# EAGLE design V2 (EAGLE 6.5.0)
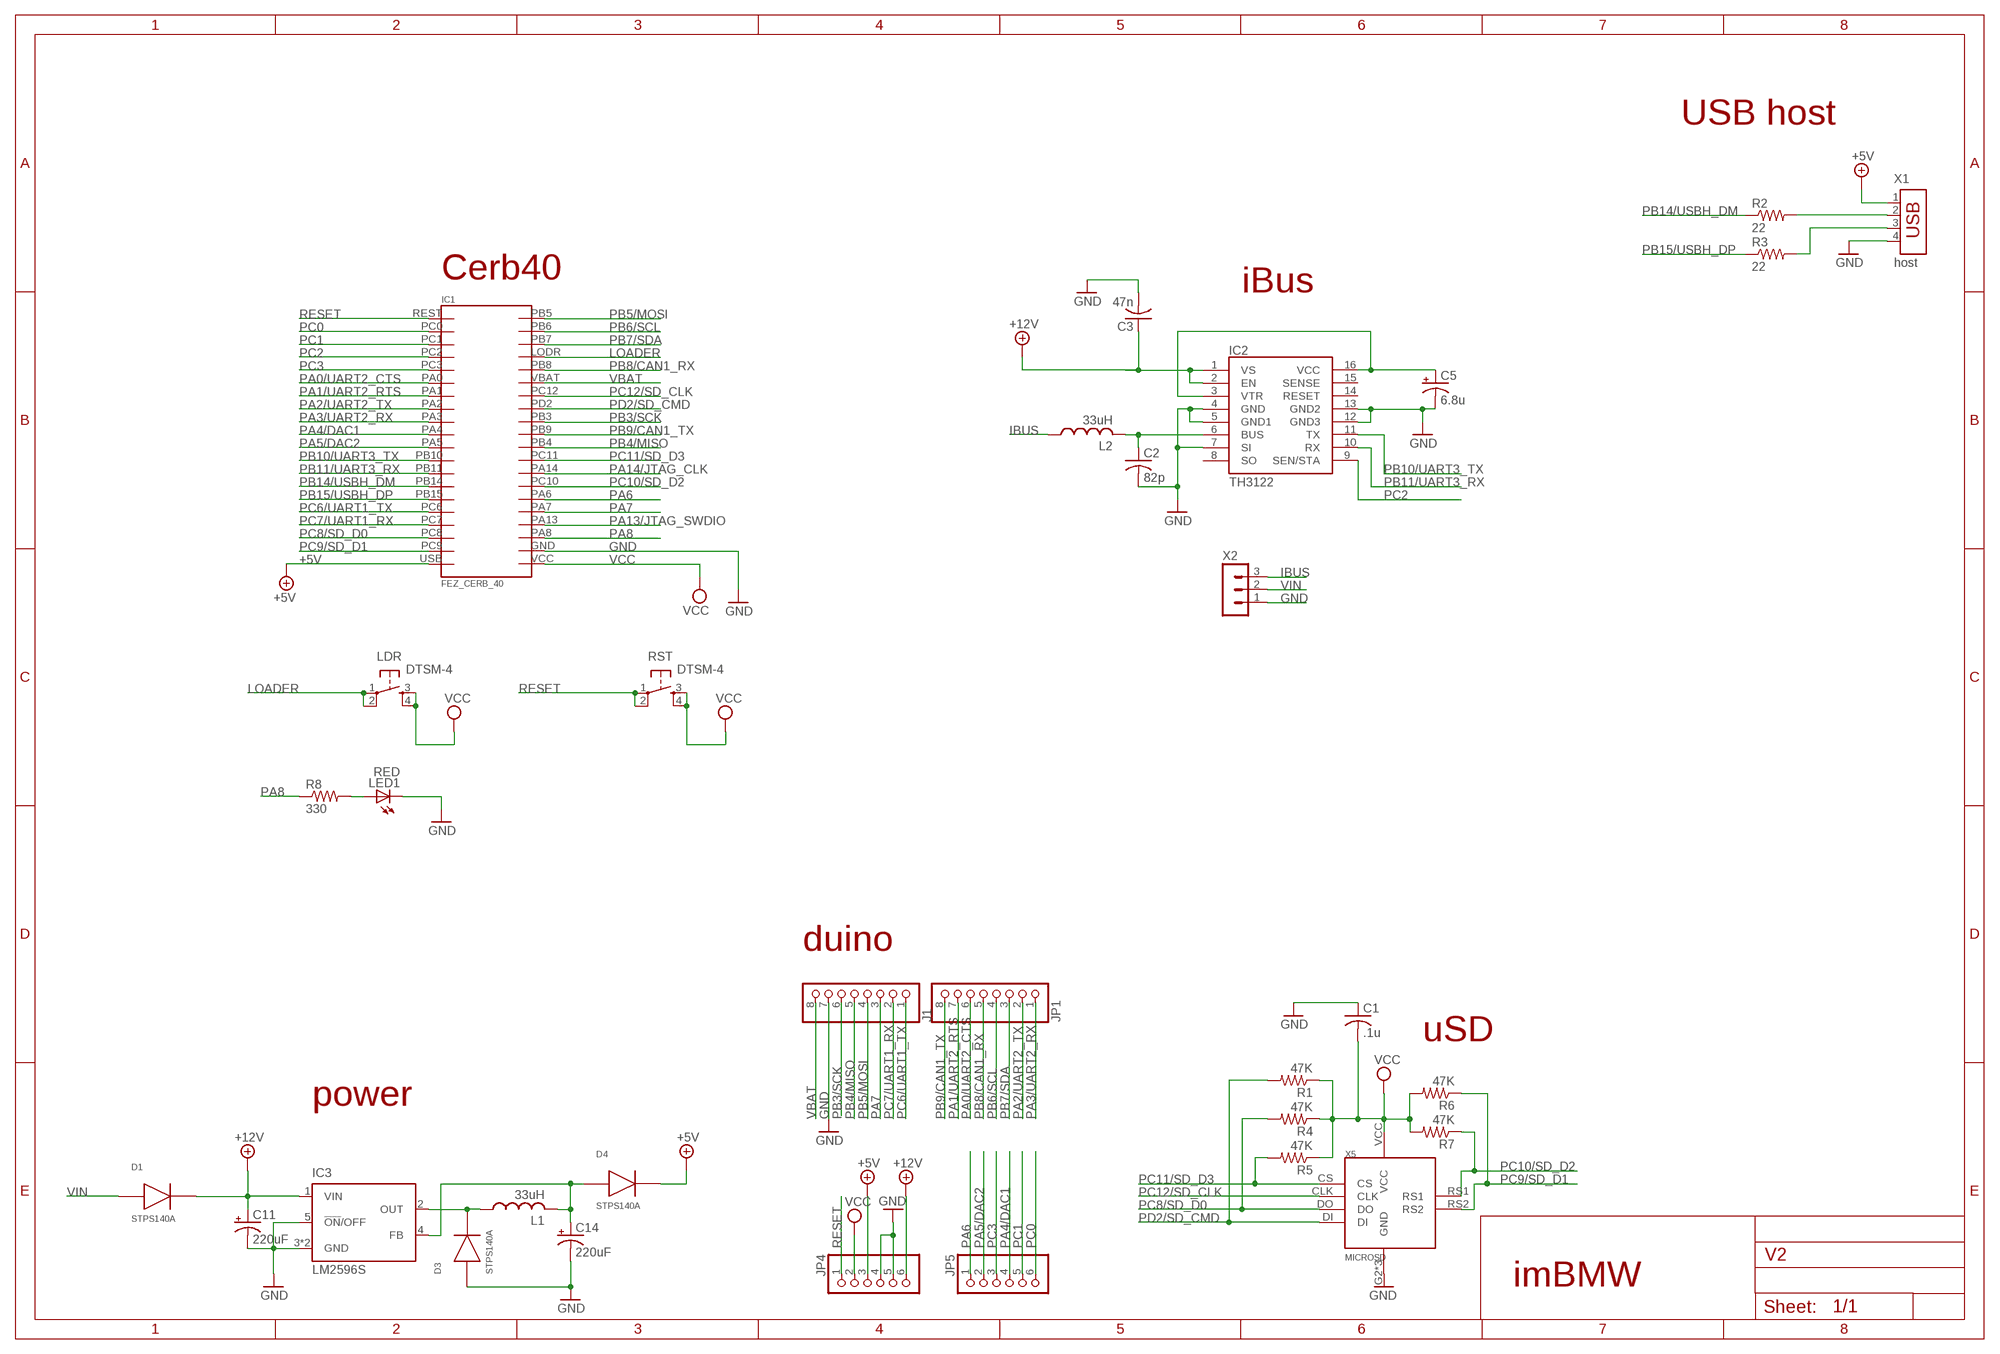
[diagram p0: schematic, sheet 1]

## Parts
C1  .1u  C-USC0805  [C0805]
C2  82p  C-USC0805  [C0805]
C3  47n  C-USC0805  [C0805]
C5  6.8u  CPOL-USSMCB  [SMC_B]
C11  220uF  CPOL-USSMCD  [SMC_D]
C14  220uF  CPOL-USSMCD  [SMC_D]
D1  STPS140A  DIODE_SMA  [DIODE_SMA]
D3  STPS140A  DIODE_SMA  [DIODE_SMA]
D4  STPS140A  DIODE_SMA  [DIODE_SMA]
IC1  FEZ_CERB_40  [FEZ_CERB_40]
IC2  TH3122  [SO16L]
IC3  LM2596S  [TO263-5]
J1  PINHD-1X8  [1X08]
JP1  PINHD-1X8  [1X08]
JP4  PINHD-1X6  [1X06]
JP5  PINHD-1X6  [1X06]
L1  33uH  L-USWE-TPC  [POWER-CHOKE_WE-TPC]
L2  33uH  L-USWE-TPC  [POWER-CHOKE_WE-TPC]
LDR  DTSM-4  [DTSM-4]
LED1  RED  LEDSML0603  [SML0603]
R1  47K  R-US_R0805  [R0805]
R2  22  R-US_R0805  [R0805]
R3  22  R-US_R0805  [R0805]
R4  47K  R-US_R0805  [R0805]
R5  47K  R-US_R0805  [R0805]
R6  47K  R-US_R0805  [R0805]
R7  47K  R-US_R0805  [R0805]
R8  330  R-US_R0805  [R0805]
RST  DTSM-4  [DTSM-4]
X1  host  USB-787616  [USB]
X2  MA03-1  [MA03-1]
X5  MICROSD  [MICROSD]

## Nets
+5V: D4.K IC1.USB JP4.3 X1.1
+12V: C3.1 C11.+ D1.K IC2.1(VS) IC2.2(EN) IC3.1(VIN) JP4.6
GND: C1.1 C2.2 C3.2 C5.- C11.- C14.- D3.A IC1.GND IC2.4(GND) IC2.5(GND1) IC2.7(SI) IC2.12(GND3) IC2.13(GND2) IC3.3(GND) IC3.5(!ON!/OFF) IC3.6(GND) J1.7 JP4.4 JP4.5 LED1.C X1.4 X2.1 X5.G2(GND) X5.G3(GND) X5.GND
IBUS: L2.1 X2.3
LOADER: IC1.LODR LDR.1 LDR.2
N$1: C14.+ D4.A IC3.4(FB) L1.2
N$4: C2.1 IC2.6(BUS) L2.2
N$6: D3.K IC3.2(OUT) L1.1
N$11: C5.+ IC2.3(VTR) IC2.16(VCC)
N$26: LED1.A R8.2
N$146: R2.2 X1.2
N$152: R3.2 X1.3
PA0/UART2_CTS: IC1.PA0 JP1.6
PA1/UART2_RTS: IC1.PA1 JP1.7
PA2/UART2_TX: IC1.PA2 JP1.2
PA3/UART2_RX: IC1.PA3 JP1.1
PA4/DAC1: IC1.PA4 JP5.4
PA5/DAC2: IC1.PA5 JP5.2
PA6: IC1.PA6 JP5.1
PA7: IC1.PA7 J1.3
PA8: IC1.PA8 R8.1
PA13/JTAG_SWDIO: IC1.PA13
PA14/JTAG_CLK: IC1.PA14
PB3/SCK: IC1.PB3 J1.6
PB4/MISO: IC1.PB4 J1.5
PB5/MOSI: IC1.PB5 J1.4
PB6/SCL: IC1.PB6 JP1.4
PB7/SDA: IC1.PB7 JP1.3
PB8/CAN1_RX: IC1.PB8 JP1.5
PB9/CAN1_TX: IC1.PB9 JP1.8
PB10/UART3_TX: IC1.PB10 IC2.11(TX)
PB11/UART3_RX: IC1.PB11 IC2.10(RX)
PB14/USBH_DM: IC1.PB14 R2.1
PB15/USBH_DP: IC1.PB15 R3.1
PC0: IC1.PC0 JP5.6
PC1: IC1.PC1 JP5.5
PC2: IC1.PC2 IC2.9(SEN/STA)
PC3: IC1.PC3 JP5.3
PC6/UART1_TX: IC1.PC6 J1.1
PC7/UART1_RX: IC1.PC7 J1.2
PC8/SD_D0: IC1.PC8 R4.2 X5.DO
PC9/SD_D1: IC1.PC9 R6.1 X5.RS2
PC10/SD_D2: IC1.PC10 R7.1 X5.RS1
PC11/SD_D3: IC1.PC11 R5.2 X5.CS
PC12/SD_CLK: IC1.PC12 X5.CLK
PD2/SD_CMD: IC1.PD2 R1.2 X5.DI
RESET: IC1.REST JP4.1 RST.1 RST.2
VBAT: IC1.VBAT J1.8
VCC: C1.2 IC1.VCC JP4.2 LDR.3 LDR.4 R1.1 R4.1 R5.1 R6.2 R7.2 RST.3 RST.4 X5.VCC
VIN: D1.A X2.2
Unconnected: IC2.8(SO) IC2.14(RESET) IC2.15(SENSE)

## Notes on the sheet
- USB host
- Cerb40
- iBus
- duino
- uSD
- power
- imBMW

## Library data of the parts
C1-C3 = rcl:C-US: CAPACITOR, American symbol
C5 C11 C14 = rcl:CPOL-US: POLARIZED CAPACITOR, American symbol
D1 D3 D4 = GHI:DIODE_SMA
IC1 = ozlollc:FEZ_CERB_40: FEZ Cerb 40 GHI Electronics STM32F4 http://www.ghielectronics.com/catalog/product/353; VERSION: 1.1
IC2 = toxs:TH3122: Melexis TH3122 iBus transceiver
IC3 = national-semiconductor:LM2596: SIMPLE SWITCHER® Power Converter 150 kHz 3A Step-Down Voltage Regulator Source: http://www.national.com/ds/LM/LM2596.pdf; MF: NATIONAL SEMICONDUCTOR; MPN: LM2596S-ADJ/NOPB; OC_FARNELL: 9494367; OC_NEWARK: 41K3842
J1 JP1 = pinhead:PINHD-1X8: PIN HEADER
JP4 JP5 = pinhead:PINHD-1X6: PIN HEADER
L1 L2 = rcl:L-US: INDUCTOR, American symbol
LDR RST = switch-tact:DTSM-4
LED1 = led:LED: LED OSRAM: - CHIPLED LG R971, LG N971, LY N971, LG Q971, LY Q971, LO R971, LY R971 LH N974, LH R974 LS Q976, LO Q976, LY Q976 LO Q996 - Hyper CHIPLED LW Q18S LB Q993, LB Q99A, LB R99A - SideLED LS A670, LO A670, LY A670, LG A670, LP A670 LB A673, LV A673, LT A673, LW A673 LH A674 LY A675 LS A676, LA A676, LO A676, LY A676, LW A676 LS A679, LY A679, LG A679 - Hyper Micro SIDELED® LS Y876, LA Y876, LO Y876, LY Y876 LT Y87S - SmartLED LW L88C, LW L88S LB L89C, LB L89S, LG L890 LS L89K, LO L89K, LY L89K LS L896, LA L896, LO L896, LY L896 - TOPLED LS T670, LO T670, LY T670, LG T670, LP T670 LSG T670, LSP T670, LSY T670, LOP T670, LYG T670 LG T671, LOG T671, LSG T671 LB T673, LV T673, LT T673, LW T673 LH T674 LS T676, LA T676, LO T676, LY T676, LB T676, LH T676, LSB T676, LW T676 LB T67C, LV T67C, LT T67C, LS T67K, LO T67K, LY T67K, LW E67C LS E67B, LA E67B, LO E67B, LY E67B, LB E67C, LV E67C, LT E67C LW T67C LS T679, LY T679, LG T679 LS T770, LO T770, LY T770, LG T770, LP T770 LB T773, LV T773, LT T773, LW T773 LH T774 LS E675, LA E675, LY E675, LS T675 LS T776, LA T776, LO T776, LY T776, LB T776 LHGB T686 LT T68C, LB T68C - Hyper Mini TOPLED® LB M676 - Mini TOPLED Santana® LG M470 LS M47K, LO M47K, LY M47K Source: http://www.osram.convergy.de LUXEON: - LUMILED® LXK2-PW12-R00, LXK2-PW12-S00, LXK2-PW14-U00, LXK2-PW14-V00 LXK2-PM12-R00, LXK2-PM12-S00, LXK2-PM14-U00 LXK2-PE12-Q00, LXK2-PE12-R00, LXK2-PE12-S00, LXK2-PE14-T00, LXK2-PE14-U00 LXK2-PB12-K00, LXK2-PB12-L00, LXK2-PB12-M00, LXK2-PB14-N00, LXK2-PB14-P00, LXK2-PB14-Q00 LXK2-PR12-L00, LXK2-PR12-M00, LXK2-PR14-Q00, LXK2-PR14-R00 LXK2-PD12-Q00, LXK2-PD12-R00, LXK2-PD12-S00 LXK2-PH12-R00, LXK2-PH12-S00 LXK2-PL12-P00, LXK2-PL12-Q00, LXK2-PL12-R00 Source: www.luxeon.com KINGBRIGHT: KA-3528ASYC Source: www.kingbright.com
R1-R8 = rcl:R-US_: RESISTOR, American symbol
X1 = con-amp:USB-787616: AMP connector
X2 = con-lstb:MA03-1: PIN HEADER; OC_FARNELL: unknown; OC_NEWARK: unknown
X5 = toxs:MICROSD

## Net classes
0 default: width 0.254 mm, drill 0.381 mm, clearance 0.203 mm
2 gnd: width 0.254 mm, drill 0.381 mm, clearance 0.203 mm
3 usbvcc: width 0.508 mm, drill 0.508 mm, clearance 2.235 mm

## Board
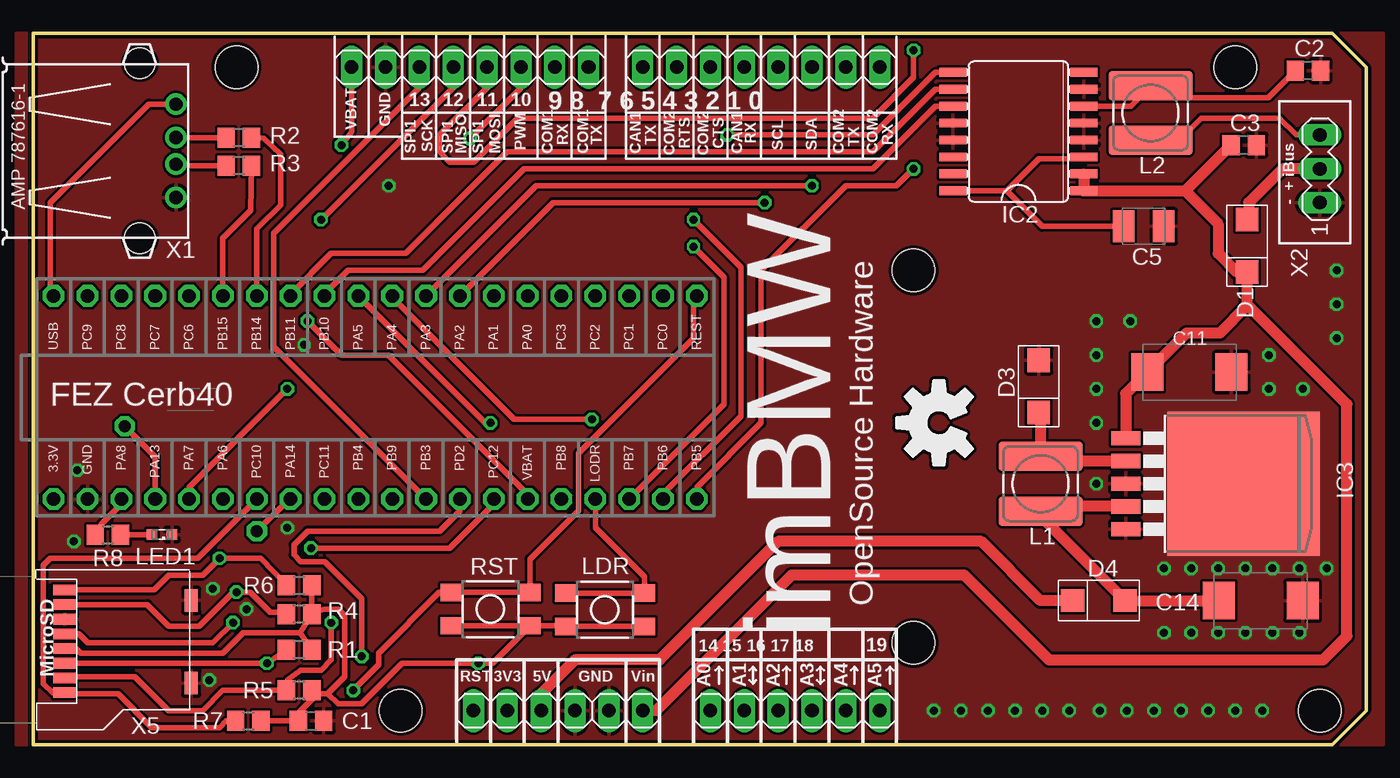
[diagram p1: board, top side]
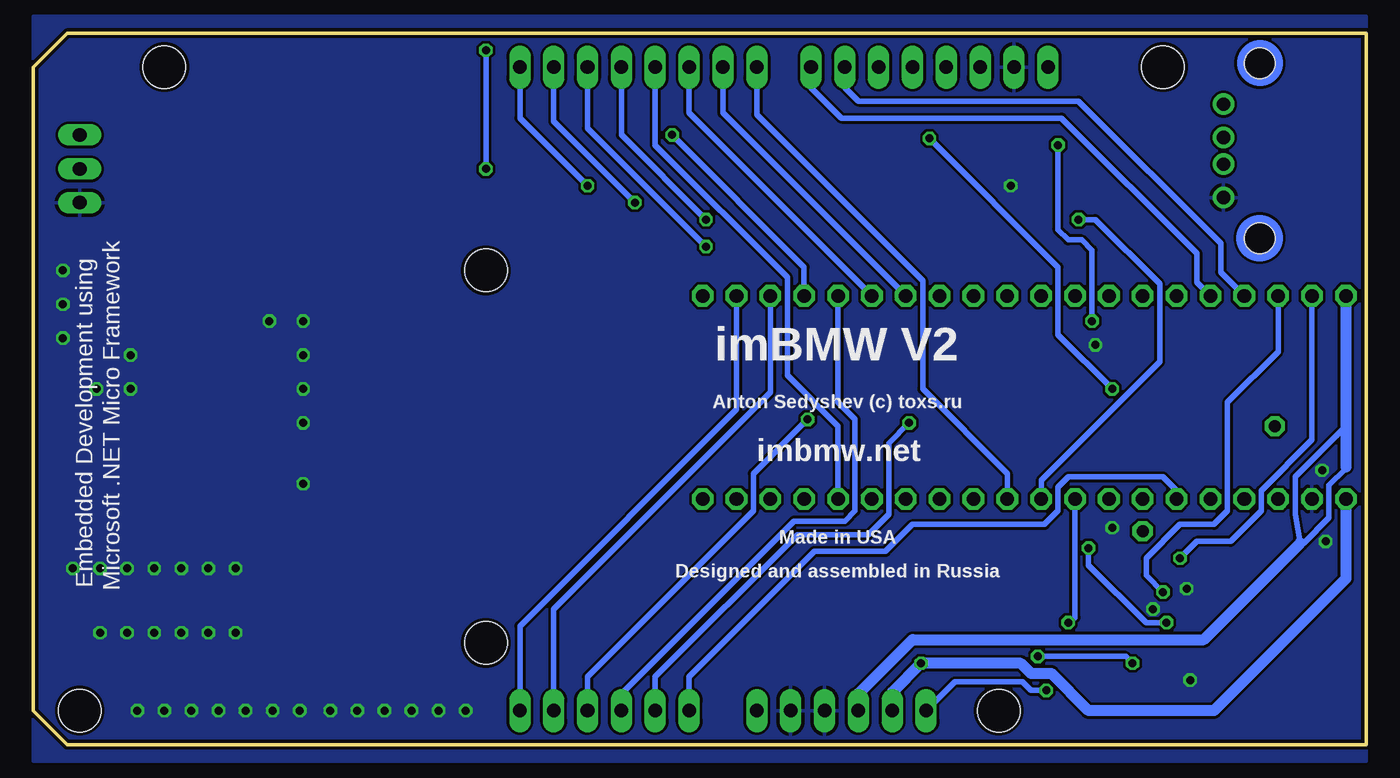
[diagram p2: board, bottom side, seen from below]

Size 100 x 53.34 mm. Coordinates in mm from the lower left corner, seen from the top.
Outline: 0,53.34 97.46,53.34 100,50.8 100,2.54 97.46,0 0,0 0,53.34
Copper layers (1*16): Top 0.035mm / dielectric 1.5mm / Bottom 0.035mm
Design rules "DFRobot_Eagle_Rule_v0.4": minimum track width 6mil, minimum drill 12mil, track to track 6mil, track to pad 6mil, pad to pad 6mil, via to via 6mil, smd to smd 0mil, copper to edge 10mil, drill to drill 10mil, minimum pad ring 12mil, minimum via ring 8mil, stop-mask expansion 2mil, vias tented up to drill 25mil, thermal gap 10mil
Holes 3.2 mm at 66.04,35.56 66.04,7.62 15.24,50.8 96.52,2.54 90.17,50.8 27.56,2.54

### Footprints (pad centres in the part's own frame; a part is rotated, then mirrored left to right if it is on the bottom)
C0805 = smd 1.3 x 1.5: 1 -0.95,0; 2 0.95,0
SMC_B = smd 1.6 x 2.4: + -1.5,0; - 1.5,0
SMC_D = smd 2.4 x 2.8: + -3.15,0; - 3.15,0
DIODE_SMA = smd 1.778 x 1.676: A -1.905,0; K 2.032,0
FEZ_CERB_40 = drill 1.016 pad 1.524 octagon: GND 4.064,1.524; LODR 42.164,1.524; PA0 37.084,16.764; PA1 34.544,16.764; PA2 32.004,16.764; PA3 29.464,16.764; PA4 26.924,16.764; PA5 24.384,16.764; PA6 14.224,1.524; PA7 11.684,1.524; PA8 6.604,1.524; PA13 9.144,1.524; PA14 19.304,1.524; PB3 29.464,1.524; PB4 24.384,1.524; PB5 49.784,1.524; PB6 47.244,1.524; PB7 44.704,1.524; PB8 39.624,1.524; PB9 26.924,1.524; PB10 21.844,16.764; PB11 19.304,16.764; PB14 16.764,16.764; PB15 14.224,16.764; PC0 47.244,16.764; PC1 44.704,16.764; PC2 42.164,16.764; PC3 39.624,16.764; PC6 11.684,16.764; PC7 9.144,16.764; PC8 6.604,16.764; PC9 4.064,16.764; PC10 16.764,1.524; PC11 21.844,1.524; PC12 34.544,1.524; PD2 32.004,1.524; REST 49.784,16.764; USB 1.524,16.764; VBAT 37.084,1.524; VCC 1.524,1.524
SO16L = smd 0.66 x 2.032: 1 -4.445,-4.902; 2 -3.175,-4.902; 3 -1.905,-4.902; 4 -0.635,-4.902; 5 0.635,-4.902; 6 1.905,-4.902; 7 3.175,-4.902; 8 4.445,-4.902; 9 4.445,4.902; 10 3.175,4.902; 11 1.905,4.902; 12 0.635,4.902; 13 -0.635,4.902; 14 -1.905,4.902; 15 -3.175,4.902; 16 -4.445,4.902
TO263-5 = smd 1.067 x 2.159: 1 -3.404,-5.791; 2 -1.702,-5.791; 3 0,-5.791; 4 1.702,-5.791; 5 3.404,-5.791 | smd 10.8 x 11.426: 6 0,3.048
1X08 = drill 1.016 long: 1 -8.89,0; 2 -6.35,0; 3 -3.81,0; 4 -1.27,0; 5 1.27,0; 6 3.81,0; 7 6.35,0; 8 8.89,0
1X06 = drill 1.016 long: 1 -6.35,0; 2 -3.81,0; 3 -1.27,0; 4 1.27,0; 5 3.81,0; 6 6.35,0
POWER-CHOKE_WE-TPC = smd 6.3 x 2.2: 1 0,2.05; 2 0,-2.05
DTSM-4 = smd 1.55 x 1.3: 1 -2.975,1.25; 2 2.975,1.25; 3 -2.975,-1.25; 4 2.975,-1.25
SML0603 = smd 0.8 x 0.8: A 0.75,0; C -0.75,0
R0805 = smd 1.3 x 1.5: 1 -0.95,0; 2 0.95,0
USB = drill 1: 1 -3.5,12.99; 2 -1,12.99; 3 1,12.99; 4 3.5,12.99 | hole 2.3: -6.57,10.28; 6.57,10.28
MA03-1 = drill 1.016 long: 1 -2.54,0; 2 0,0; 3 2.54,0
MICROSD = smd 0.8 x 1.7: CLK 1.18,3.9; CS -2.12,3.9; DI -1.02,3.9; DO 3.38,3.9; GND 2.28,3.9; RS1 -3.22,3.9; RS2 4.48,3.9; VCC 0.08,3.9 | smd 1.7 x 1: G2 -2.5,-5.6; G3 3.7,-5.6

### Placement (x,y rotation side)
C1  20.83,1.78 180 top
C2  95.63,50.55 0 top
C3  90.81,44.96 0 top
C5  83.31,38.86 0 top
C11  86.74,27.94 0 top
C14  92.08,10.79 0 top
D1  91.06,37.47 270 top
D3  75.44,26.92 270 top
D4  80.01,10.79 180 top
IC1  0,16.89 0 top
IC2  73.91,45.97 90 top
IC3  87.76,19.56 270 top
J1  32.77,50.8 180 top
JP1  54.61,50.8 180 top
JP4  39.37,2.54 0 top
JP5  57.15,2.54 0 top
L1  75.56,19.56 0 top
L2  83.82,47.37 180 top
LDR  42.88,10.11 0 top
LED1  9.65,15.75 180 top
R1  19.94,7.11 180 top
R2  15.42,45.52 180 top
R3  15.42,43.41 180 top
R4  19.94,9.78 180 top
R5  19.94,4.06 180 top
R6  19.94,11.94 0 top
R7  16.13,1.78 0 top
R8  5.59,15.75 0 top
RST  34.29,10.16 0 top
X1  -2.29,44.53 270 top
X2  96.52,43.18 90 top
X5  6.25,7.11 90 top

### Tracks (layer width: path | path; a pad name or v marks a point on that pad's centre or on a via)
+5V
  Top 0.406: IC1.USB 1.27,33.91 1.27,40.64 8.66,48.03 X1.1
  Top 0.813: D4.K 75.56,10.79 71.12,15.24 55.88,15.24 46.99,6.35 40.64,6.35 38.1,3.81 JP4.3
  Bottom 0.406: 1.52,20.83 1.52,20.7 2.79,19.43 2.79,17.02 4.7,15.11 4.95,15.11 5.33,17.27 5.33,20.07 1.52,23.88
  Bottom 0.813: IC1.USB 1.52,23.88 1.52,20.83 | JP4.3 38.1,3.81 34.04,7.87 12.19,7.87 4.95,15.11
+12V
  Top 0.813: 91.06,33.02 D1.K 90.3,35.43 88.9,36.83 88.9,39.05 86.43,41.53 | 91.06,33.02 91.06,32.89 89.03,30.86 86.51,30.86 C11.+ 81.97,26.32 IC3.1 | 91.06,33.02 98.55,25.53 98.55,8.13 96.77,6.35 76.2,6.35 69.85,12.7 56.9,12.7 46.74,2.54 JP4.6 | IC2.2 IC2.1 86.43,41.53 | 86.43,41.53 C3.1
GND  (via drill 0.6)
  other vias: 3.3,20.57 13.21,4.83 3.05,15.24 82.3,31.75 79.76,29.21 79.76,26.67 92.71,29.21 92.71,26.67 95.25,26.67 97.79,30.48 84.84,13.21 86.87,13.21 88.9,13.21 90.93,13.21 92.96,13.21 95,13.21 97.03,13.21 86.87,8.38 88.9,8.38 95,8.38 26.67,41.91 20.32,29.97 79.76,24.13 79.76,31.75 79.76,19.56 97.79,33.02 97.79,35.56 92.96,8.38 90.93,8.38 84.84,8.38 13.46,11.68 16,10.16 19.05,16.26 80.01,2.54 82.04,2.54 84.07,2.54 86.11,2.54 88.14,2.54 90.17,2.54 92.2,2.54 69.6,2.54 71.63,2.54 77.72,2.54 75.69,2.54 73.66,2.54 67.56,2.54
  pour Top (rank 6): -1.27,53.34 -1.27,0 101.27,0 101.27,53.34
  pour Bottom (rank 2): 0,54.61 0,-1.27 100,-1.27 100,54.61
  pour Top (no thermals): 83.82,25.4 97.03,25.4 97.03,13.72 83.82,13.72
IBUS
  Top 0.406: X2.3 94.74,45.72 93.47,46.99 87.63,46.99 85.96,45.32 L2.1
LOADER
  Top 0.406: LDR.1 LDR.2 45.85,12.57 42.16,16.26 IC1.LODR
N$1
  Top 0.813: IC3.4 77.13,17.86 76.78,17.51 L1.2 75.56,17.14 D4.A C14.+
N$4
  Top 0.406: C2.1 92.65,48.51 84.47,48.51 L2.2 83.6,49.15 82.33,47.88 IC2.6
N$5
  Top 0.254: 69.96,24.96 arc10 69.8,25.29 70.45,26.09 69.9,26.63 69.1,25.98 arc19 68.44,26.26 68.33,27.28 67.56,27.28 67.45,26.26 arc19 66.79,25.98 65.99,26.63 65.44,26.09 66.09,25.29 arc19 65.82,24.62 64.79,24.52 64.79,23.74 65.82,23.64 arc19 66.09,22.97 65.44,22.18 65.99,21.63 66.79,22.28 arc19 67.45,22 67.56,20.98 68.33,20.98 68.44,22 arc19 69.1,22.28 69.9,21.63 70.45,22.18 69.8,22.97 arc10 69.96,23.3 68.86,23.75 arc-68 67.94,23.14 arc-248 68.86,24.51 69.96,24.96
N$6
  Top 0.813: IC3.2 77.47,21.26 | 77.47,21.26 77.13,21.26 | 77.47,21.26 77.09,21.64 76.71,21.64 76.67,21.61 L1.1 75.56,24.77 D3.K
N$11
  Top 0.406: IC2.16 73.03,41.53 | 73.03,41.53 75.44,43.94 78.69,43.94 IC2.3 | C5.+ 75.69,38.86 73.03,41.53
N$26
  Top 0.406: R8.2 LED1.A
N$146
  Top 0.406: X1.2 11.96,45.52 R2.2
N$152
  Top 0.406: X1.3 11.86,43.41 R3.2
PA0/UART2_CTS
  Bottom 0.406: IC1.PA0 50.8,47.37 JP1.6
PA1/UART2_RTS
  Bottom 0.406: IC1.PA1 48.26,47.37 JP1.7
PA2/UART2_TX  (via drill 0.6)
  Top 0.406: v54.86,40.64 38.99,40.64 IC1.PA2
  Bottom 0.406: JP1.2 60.96,46.74 v54.86,40.64
PA3/UART2_RX  (via drill 0.6)
  Top 0.406: v58.42,41.91 37.72,41.91 IC1.PA3
  Bottom 0.406: JP1.1 63.5,46.99 v58.42,41.91
PA4/DAC1  (via drill 0.6)
  Top 0.406: IC1.PA4 26.92,33.53 36.07,24.38 v41.91,24.38
  Bottom 0.406: v41.91,24.38 45.97,20.32 45.97,17.53 58.42,5.08 JP5.4
PA5/DAC2  (via drill 0.6)
  Top 0.406: v34.29,24.13 33.91,24.13 IC1.PA5
  Bottom 0.406: v34.29,24.13 35.81,22.61 35.81,17.27 37.34,15.75 42.67,15.75 53.34,5.08 JP5.2
PA6
  Bottom 0.406: JP5.1 50.8,5.08 41.4,14.48 36.07,14.48 34.04,16.51 24.13,16.51 23.11,17.53 23.11,19.3 22.35,20.07 15.24,20.07 14.22,19.05 IC1.PA6
PA7  (via drill 0.6)
  Top 0.406: IC1.PA7 11.68,19.3 v19.05,26.67 | J1.3 36.58,49.28 v32.77,45.47
  Bottom 0.406: v19.05,26.67 23.11,30.73 23.11,35.81 v32.77,45.47
PA8
  Top 0.406: IC1.PA8 6.6,18.03 5.08,16.51 5.08,16.09 R8.1
PA13/JTAG_SWDIO  (via drill 0.9 pad 1.52)
  Top 0.406: v6.86,23.88 9.14,21.59 IC1.PA13
PA14/JTAG_CLK  (via drill 0.9 pad 1.52)
  Top 0.406: IC1.PA14 19.18,18.41 v16.76,16
PB3/SCK
  Top 0.406: J1.6 28.96,49.28 18.03,38.35 18.03,29.84 IC1.PB3
PB4/MISO  (via drill 0.6)
  Top 0.406: J1.5 31.75,50.55 31.75,49.53 v21.59,39.37
  Bottom 0.406: IC1.PB4 24.38,19.81 15.49,28.7 15.49,34.54 20.32,39.37 v21.59,39.37
PB5/MOSI  (via drill 0.6)
  Top 0.406: IC1.PB5 49.78,19.3 54.61,24.13 54.61,35.56 60.96,41.91 64.77,41.91 v66.04,43.18 | J1.4 34.29,50.55 34.29,49.53 30.48,45.72 30.48,44.45 31.24,43.69 33.02,43.69 36.32,46.99 62.99,46.99 66.04,50.04 v66.04,52.07
  Bottom 0.406: v66.04,43.18 v66.04,52.07
PB6/SCL  (via drill 0.6)
  Top 0.406: v49.53,39.37 53.09,35.81 53.09,24.64 47.24,18.8 IC1.PB6
  Bottom 0.406: JP1.4 55.88,45.72 v49.53,39.37
PB7/SDA  (via drill 0.6)
  Top 0.406: v49.53,37.34 51.82,35.05 51.82,25.53 IC1.PB7
  Bottom 0.406: JP1.3 58.42,46.23 v49.53,37.34
PB8/CAN1_RX
  Bottom 0.406: JP1.5 53.34,44.96 43.43,35.05 43.43,27.69 39.62,23.88 IC1.PB8
PB9/CAN1_TX
  Bottom 0.406: JP1.8 45.72,47.24 33.27,34.8 33.27,26.67 26.92,20.32 IC1.PB9
PB10/UART3_TX
  Top 0.406: IC1.PB10 21.72,33.66 23.62,35.56 29.21,35.56 36.83,43.18 62.99,43.18 67.69,47.88 IC2.11
PB11/UART3_RX
  Top 0.406: IC1.PB11 19.3,33.78 22.35,36.83 27.94,36.83 35.56,44.45 62.99,44.45 67.69,49.15 IC2.10
PB14/USBH_DM
  Top 0.406: R2.1 17.27,45.47 18.54,44.26 18.54,40.45 16.76,38.67 IC1.PB14
PB15/USBH_DP
  Top 0.406: 16,43.09 R3.1 16.32,40.07 14.22,37.97 IC1.PB15
PC0
  Bottom 0.406: IC1.PC0 47.24,25.15 63.5,8.89 JP5.6
PC1
  Bottom 0.406: IC1.PC1 44.7,26.42 60.96,10.16 JP5.5
PC2  (via drill 0.6)
  Top 0.406: v52.07,45.72 62.99,45.72 67.69,50.42 IC2.9
  Bottom 0.406: IC1.PC2 42.16,35.81 v52.07,45.72
PC3
  Bottom 0.406: IC1.PC3 39.62,25.65 38.35,24.38 38.35,17.53 39.12,16.76 42.93,16.76 55.88,3.81 JP5.3
PC6/UART1_TX
  Bottom 0.406: J1.1 41.66,49.28 39.37,46.99 22.86,46.99 12.7,36.83 12.7,34.67 IC1.PC6
PC7/UART1_RX
  Bottom 0.406: J1.2 39.12,49.28 38.1,48.26 21.59,48.26 10.92,37.59 10.92,35.43 IC1.PC7
PC8/SD_D0  (via drill 0.6)
  Top 0.406: X5.DO 8.56,10.49 10.16,8.89 12.45,8.89 14.99,11.43 v15.24,11.43 16.26,11.43 17.78,9.91 18.96,9.91 R4.2
  Bottom 0.406: IC1.PC8 6.6,29.46 10.41,25.65 10.41,17.53 11.43,16.51 13.97,16.51 16.51,13.97 16.51,12.7 v15.24,11.43
PC9/SD_D1  (via drill 0.6)
  Top 0.406: X5.RS2 9.05,11.59 10.16,12.7 12.7,12.7 v13.97,13.97 17.06,13.97 R6.1
  Bottom 0.406: IC1.PC9 4.06,22.86 7.87,19.05 7.87,17.53 10.16,15.24 12.7,15.24 v13.97,13.97
PC10/SD_D2
  Top 0.406: R7.1 14.48,1.78 13.97,1.27 8.89,1.27 6.35,3.81 2.53,3.81 X5.RS1 1.44,3.89 0.76,4.57 0.76,13.46 1.27,13.97 12.32,13.97 IC1.PC10
PC11/SD_D3  (via drill 0.6)
  Top 0.406: X5.CS 2.54,5.08 7.62,5.08 10.16,2.54 12.7,2.54 14.22,4.06 R5.2 19.09,4.87 20.07,5.59 21.59,5.59 22.35,6.35 v22.35,9.14
  Bottom 0.406: v22.35,9.14 21.84,9.53 IC1.PC11
PC12/SD_CLK  (via drill 0.6)
  Top 0.406: X5.CLK 3.39,8.29 4.06,7.62 13.46,7.62 v14.99,9.14 | IC1.PC12 34.29,18.16 34.29,17.78 31.24,14.73 v20.83,14.73
  Bottom 0.406: v14.99,9.14 16.51,9.14 20.83,13.46 v20.83,14.73
PD2/SD_CMD  (via drill 0.6)
  Top 0.406: X5.DI 17.56,6.09 v17.53,6.1 R1.2 18.58,6.6 | IC1.PD2 32,17.53 30.48,16 20.57,16 19.56,14.99 19.56,14.22 20.07,13.72 21.84,13.72 24.64,10.92 v24.64,6.6
  Bottom 0.406: v17.53,6.1 18.03,6.6 v24.64,6.6
RESET  (via drill 0.6)
  Top 0.406: IC1.REST 49.53,33.4 49.53,30.48 40.89,21.84 40.89,17.53 37.27,13.9 RST.2 RST.1 30.46,11.41 25.91,6.86 25.91,5.97 v24,4.06
  Bottom 0.406: JP4.1 30.86,4.7 25.78,4.7 25.15,4.06 v24,4.06
VBAT  (via drill 0.6)
  Top 0.406: v23.11,44.96 23.88,45.97 J1.8 | v20.57,31.75 23.11,29.21 26.67,29.21 36.83,19.05 36.83,18.67 IC1.VBAT
  Bottom 0.406: v20.57,31.75 20.57,37.08 21.34,37.85 22.35,37.85 23.11,38.61 v23.11,44.96
VCC  (via drill 0.6)
  Top 0.406: R6.2 R4.1 | R7.2 C1.2 19.88,2.35 21.08,3.56 21.08,3.87 R5.1 21.04,3.81 22.1,3.81 | LDR.4 LDR.3 39.9,8.91 RST.4 | RST.3 RST.4 | RST.4 34.45,6.1 v33.4,6.1 27.69,6.1 24.64,3.05 22.86,3.05 22.1,3.81 | 22.1,3.81 23.37,5.08 23.37,9.65 22.86,10.16 21.84,10.16 20.92,9.91 R4.1 | R4.1 20.03,8.38 | 20.03,8.38 R1.1 | 20.03,8.38 15.75,8.38 14.22,6.86 3.56,6.86 3.22,7.19 X5.VCC
  Bottom 0.813: JP4.2 35.56,3.94 v33.4,6.1 25.91,6.1 25.15,5.33 23.62,5.33 20.83,2.54 11.43,2.54 1.52,12.45 IC1.VCC
VIN
  Top 0.813: X2.2 93.73,43.18 91.19,40.64 91.19,39.5 D1.A
(copper drawn outside any net)
  shapes: Bottom circle x2

### Text on the board
tPlace: 13 | 12 | 11 | 10 | 9 8 7 6 5 4 3 2 1 0 | VBAT | GND | PWM | RX | TX | TX | RTS | CTS | RX | SCL | SDA | TX | RX | SPI1 | SCK | SPI1 | MISO | SPI1 | MOSI | COM1 | COM1 | CAN1 | COM2 | COM2 | CAN1 | COM2 | COM2 | - + iBus | imBMW | FEZ Cerb40 | MicroSD | OpenSource Hardware | 14 15 16 17 18 | 19 | RST | 3V3 | 5V | GND | Vin | A0 | A1 | A2 | A3 | A4 | A5
bPlace: Microsoft .NET Micro Framework | Embedded Development using | imBMW V2 | Anton Sedyshev (c) toxs.ru | imbmw.net | Made in USA | Designed and assembled in Russia